# EAGLE design PowerSupply (EAGLE 6.1)
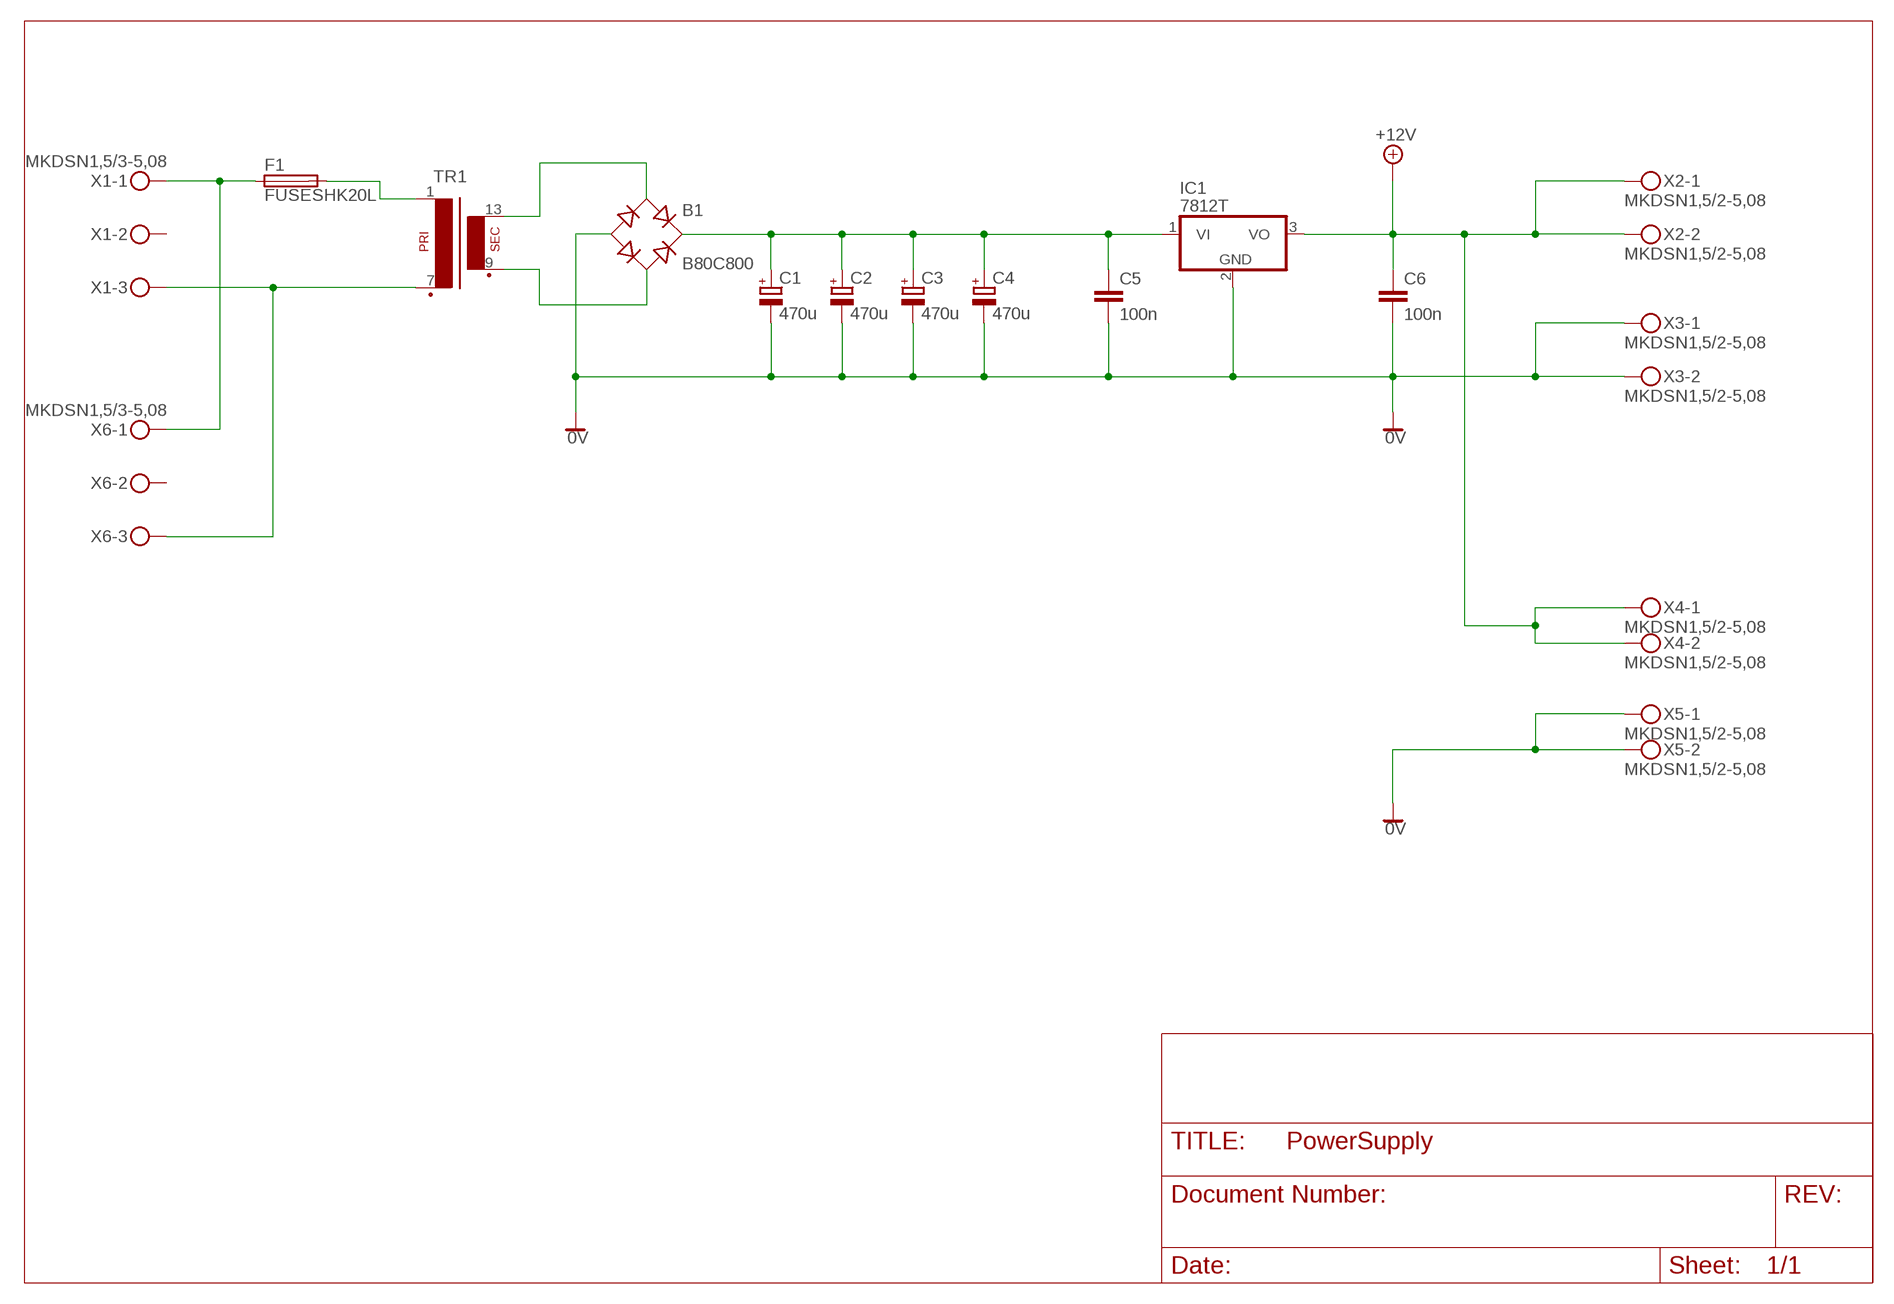
[diagram p0: schematic, sheet 1]

## Parts
B1  B80C800  B-DIL  [B-DIL]
C1  470u  CPOL-EUE5-10.5  [E5-10,5]
C2  470u  CPOL-EUE5-10.5  [E5-10,5]
C3  470u  CPOL-EUE5-10.5  [E5-10,5]
C4  470u  CPOL-EUE5-10.5  [E5-10,5]
C5  100n  C-EU050-024X044  [C050-024X044]
C6  100n  C-EU050-024X044  [C050-024X044]
F1  FUSESHK20L  [SHK20L]
IC1  7812T  [TO220H]
TR1  EI54-1B  [EI54-1B]
X1  MKDSN1,5/3-5,08  [MKDSN1,5/3-5,08]
X2  MKDSN1,5/2-5,08  [MKDSN1,5/2-5,08]
X3  MKDSN1,5/2-5,08  [MKDSN1,5/2-5,08]
X4  MKDSN1,5/2-5,08  [MKDSN1,5/2-5,08]
X5  MKDSN1,5/2-5,08  [MKDSN1,5/2-5,08]
X6  MKDSN1,5/3-5,08  [MKDSN1,5/3-5,08]

## Nets
0V: B1.- C1.- C2.- C3.- C4.- C5.2 C6.2 IC1.2(GND) X3.1 X3.2 X5.1 X5.2
+12V: C6.1 IC1.3(VO) X2.1 X2.2 X4.1 X4.2
N$1: F1.1A X1.1 X6.1
N$2: F1.2A TR1.1
N$4: B1.AC1 TR1.13(S4)
N$5: B1.AC2 TR1.9(S3)
N$6: B1.+ C1.+ C2.+ C3.+ C4.+ C5.1 IC1.1(VI)
N$8: TR1.7(P2) X1.3 X6.3
Unconnected: X1.2 X6.2

## Library data of the parts
B1 = rectifier:B-DIL: RECTIFIER
C1-C4 = rcl:CPOL-EU: POLARIZED CAPACITOR, European symbol
C5 C6 = rcl:C-EU: CAPACITOR, European symbol
F1 = fuse:FUSE: Fuse; OC_FARNELL: unknown; OC_NEWARK: unknown
IC1 = linear:78*: Positive VOLTAGE REGULATOR Source: http://cache.national.com/ds/LM/LM78L05.pdf http://www.fairchildsemi.com/ds/LM/LM7805.pdf
TR1 = trafo:EI54-1B: TRANSFORMER 1 primary winding, 1 secondary winding, mounting holes ERA
X1 X6 = con-phoenix-508:MKDSN1,5/3-5,08: MKDSN 1,5/ 3-5,08 Printklemme Nennstrom: 13,5 A Nennspannung: 250 V Rastermaß: 5,08 mm Polzahl: 3 Anschlussart: Schraubanschluss Montage: Löten Anschlussrichtung Leiter/Platine: 0 ° Artikelnummer: 1729131 Source: http://eshop.phoenixcontact.com .. 1729131.pdf; MPN: SMKDSN1,5/3-5,08; OC_FARNELL: 1792904; OC_NEWARK: 70R0299
X2-X5 = con-phoenix-508:MKDSN1,5/2-5,08: MKDSN 1,5/ 2-5,08 Printklemme Nennstrom: 13,5 A Nennspannung: 250 V Rastermaß: 5,08 mm Polzahl: 2 Anschlussart: Schraubanschluss Montage: Löten Anschlussrichtung Leiter/Platine: 0 ° Artikelnummer: 1729128 Source: http://eshop.phoenixcontact.com .. 1729128.pdf; MPN: MKDSN 1,5/2-5.08; OC_FARNELL: 1792903; OC_NEWARK: 30M2397

## Board
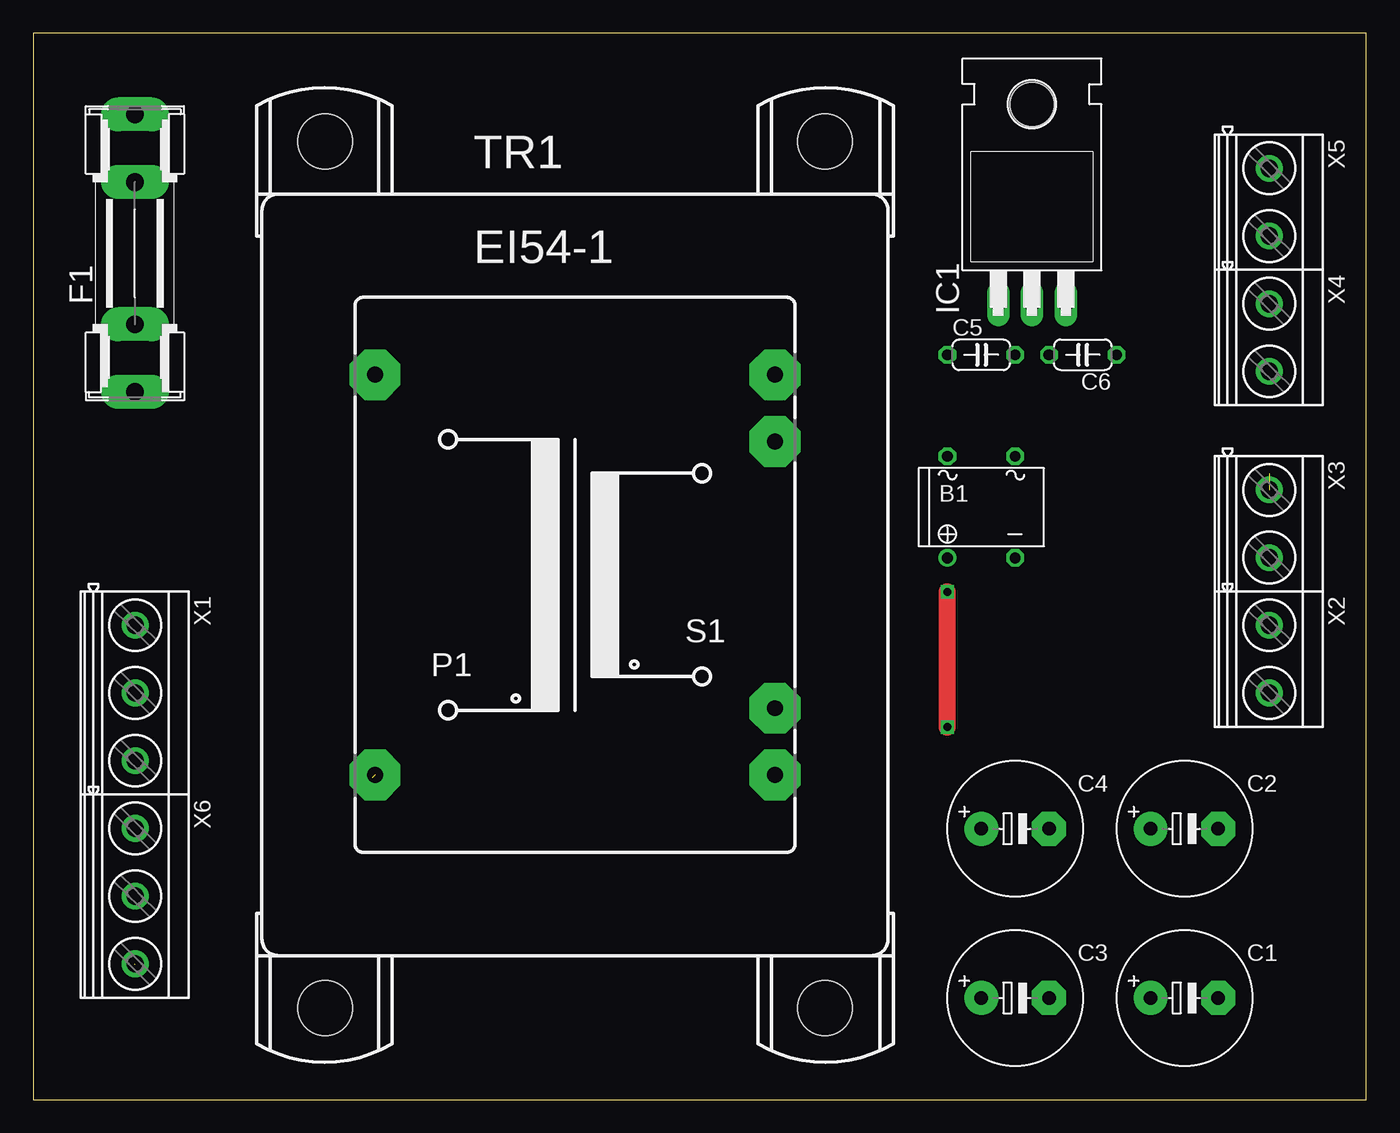
[diagram p1: board, top side]
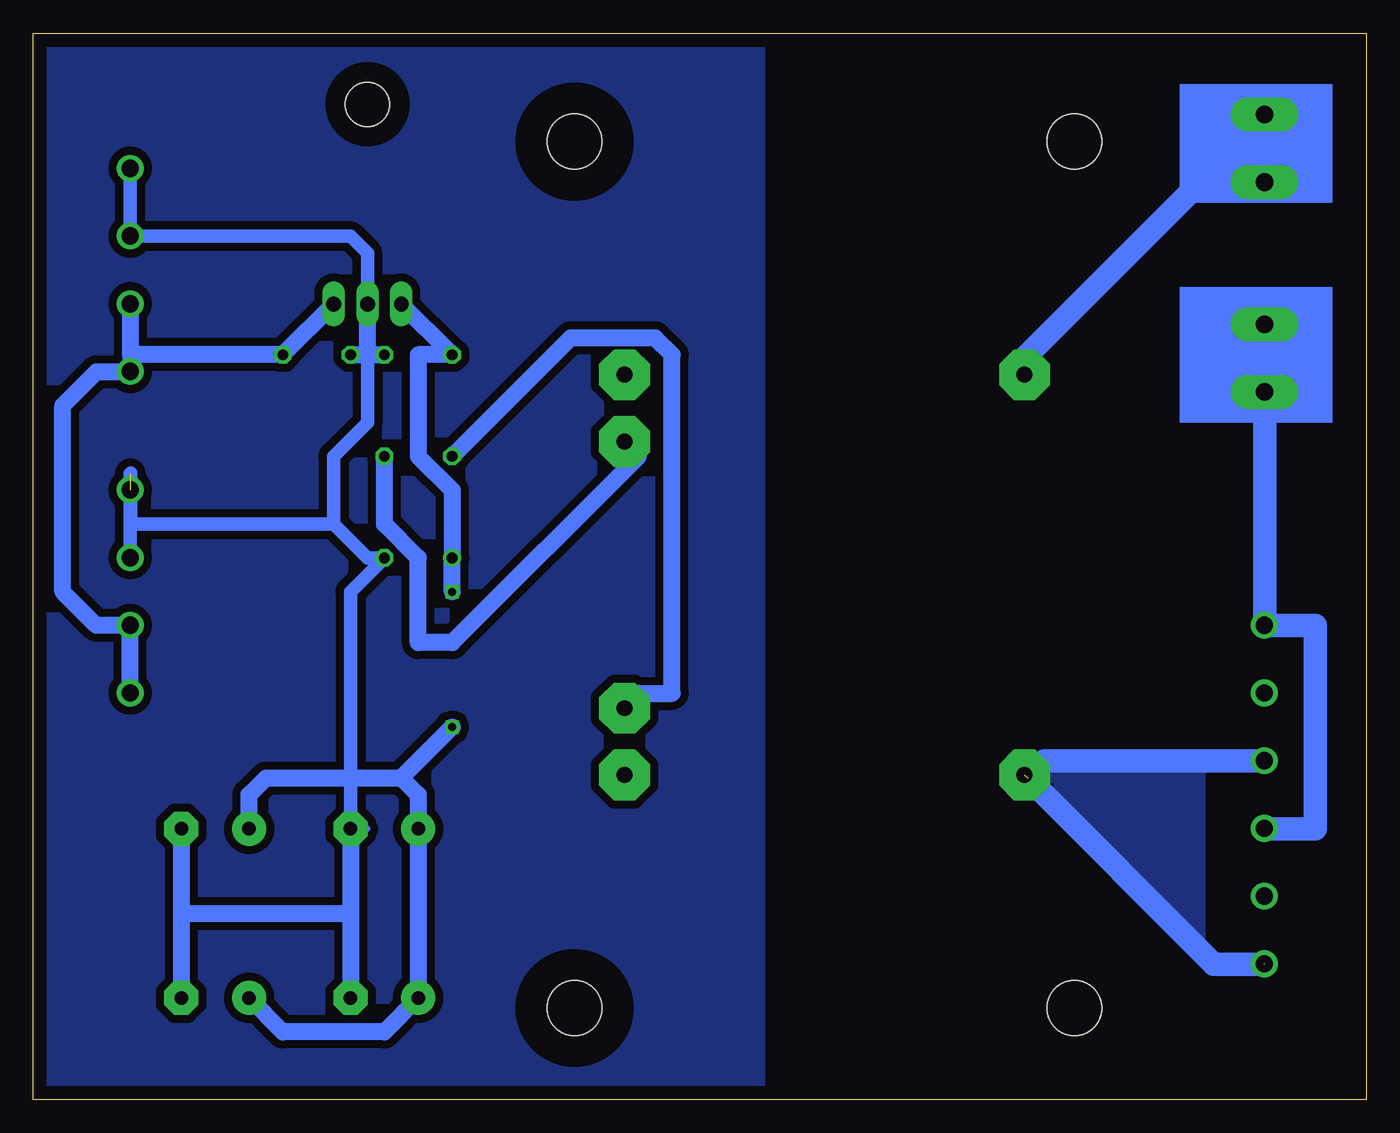
[diagram p2: board, bottom side, seen from below]

Size 100 x 80 mm. Coordinates in mm from the lower left corner, seen from the top.
Outline: 0,0 100,0 100,80 0,80 0,0
Copper layers (1*16): Top 0.035mm / dielectric 1.5mm / Bottom 0.035mm
Design rules: minimum track width 50mil, minimum drill 24mil, track to track 8mil, track to pad 8mil, pad to pad 8mil, via to via 8mil, smd to smd 8mil, copper to edge 40mil, drill to drill 8mil, minimum pad ring 10mil, minimum via ring 8mil, stop-mask expansion 4mil, vias tented up to drill 0mil, thermal gap 10mil

### Footprints (pad centres in the part's own frame; a part is rotated, then mirrored left to right if it is on the bottom)
B-DIL = drill 0.813: + -2.54,-3.81 | drill 0.813 octagon: - 2.54,-3.81; AC1 2.54,3.81; AC2 -2.54,3.81
E5-10,5 = drill 1.016 pad 2.54: + -2.54,0 | drill 1.016 pad 2.54 octagon: - 2.54,0
C050-024X044 = drill 0.813 octagon: 1 -2.54,0; 2 2.54,0
SHK20L = drill 1.321 pad 2.54 long: 1A -10.414,0; 1B -5.334,0; 2A 10.414,0; 2B 5.334,0
TO220H = drill 1.118 long: 1 -2.54,-10.16; 2 0,-10.16; 3 2.54,-10.16 | hole 3.302: 0,4.826
EI54-1B = drill 1.194 pad 3.81 octagon: 1 -15.011,15.011; 7 -15.011,-15.011; 8 15.011,-15.011; 9 15.011,-10.008; 13 15.011,10.008; 14 15.011,15.011 | hole 4.115: -18.745,-32.512; -18.745,32.512; 18.745,-32.512; 18.745,32.512
MKDSN1,5/3-5,08 = drill 1.3 pad 2: 1 -7.641,0.025; 2 -2.561,0.025; 3 2.519,0.025
MKDSN1,5/2-5,08 = drill 1.3 pad 2: 1 -2.561,0.025; 2 2.519,0.025

### Placement (x,y rotation side)
B1  71.12,44.45 0 top
C1  86.36,7.62 0 top
C2  86.36,20.32 0 top
C3  73.66,7.62 0 top
C4  73.66,20.32 0 top
C5  71.12,55.88 0 top
C6  78.74,55.88 180 top
F1  7.62,63.5 90 top
IC1  74.93,69.85 0 top
TR1  40.64,39.37 0 top
X1  7.62,27.94 270 top
X2  92.71,33.02 270 top
X3  92.71,43.18 270 top
X4  92.71,57.15 270 top
X5  92.71,67.31 270 top
X6  7.62,12.7 270 top

### Tracks (layer width: path | path; a pad name or v marks a point on that pad's centre or on a via)
0V  (1 unrouted)
  Bottom 0.406: 76.2,21.59 74.93,20.32 C4.-
  Bottom 1.016: 77.47,43.18 77.47,48.26 74.93,50.8 74.93,55.88 74.93,63.5 76.2,64.77 92.71,64.77 X5.2 X5.1 | 77.47,43.18 74.93,40.64 B1.- 76.2,38.1 76.2,21.59 | X3.2 92.73,46.97 92.71,46.99 92.71,43.18 77.47,43.18
  Bottom 1.27: C4.- 76.2,13.97 | 76.2,13.97 C3.- | C2.- 88.9,13.97 | 88.9,13.97 C1.- | 88.9,13.97 76.2,13.97 | C6.2 74.93,55.88 | 74.93,55.88 C5.2 | 74.93,55.88 IC1.2
+12V
  Bottom 1.016: 92.71,54.61 X4.2 92.71,54.66 | 92.71,59.69 X4.1
  Bottom 1.27: IC1.3 C6.1 92.71,55.88 | X2.2 X2.1 95.27,35.58 97.79,38.1 97.79,52.07 95.25,54.61 92.71,54.61 | 92.71,55.88 92.71,54.66 | 92.71,55.88 92.71,59.69
N$1
  Bottom 1.27: 7.62,20.32 X6.1 | 7.62,35.56 X1.1
  Bottom 1.778: F1.1A 7.62,35.56 3.81,35.56 3.81,20.32 7.62,20.32
N$2
  Bottom 1.27: 7.62,73.66 F1.2A
  Bottom 1.778: 7.62,73.66 26.67,54.61 TR1.1
N$3
  pour Bottom (isolate 0.61): 45.72,80.01 100.33,80.01 100.33,0 45.72,0
N$4
  Bottom 1.27: B1.AC1 73.66,43.18 71.12,40.64 71.12,34.29 68.58,34.29 54.61,48.26 TR1.13
N$5
  Bottom 1.27: B1.AC2 59.69,57.15 53.34,57.15 52.07,55.88 52.07,30.48 54.61,30.48 TR1.9
N$6  (via drill 0.6)
  Top 1.27: v68.58,27.94 v68.58,38.1
  Bottom 1.27: IC1.1 C5.1 71.12,55.88 71.12,48.26 68.58,45.72 B1.+ v68.58,38.1 | C1.+ 81.28,5.08 73.66,5.08 C3.+ C4.+ 71.12,22.86 72.39,24.13 | C2.+ 83.82,22.86 82.55,24.13 72.39,24.13 | 72.39,24.13 v68.58,27.94
N$8  (2 unrouted)
  Bottom 1.27: X1.3 7.67,25.4 | 24.13,25.4 25.4,24.13
  Bottom 1.778: 7.67,25.4 24.13,25.4 | 25.4,24.13 11.43,10.16 7.62,10.16
  pour Bottom: 12.7,25.4 12.7,11.43 25.4,24.13 24.13,25.4
(copper drawn outside any net)
  shapes: Bottom area x2